# EAGLE design ULN2003_SingleStrip_ThinkerKit_v02 (EAGLE 5.09)
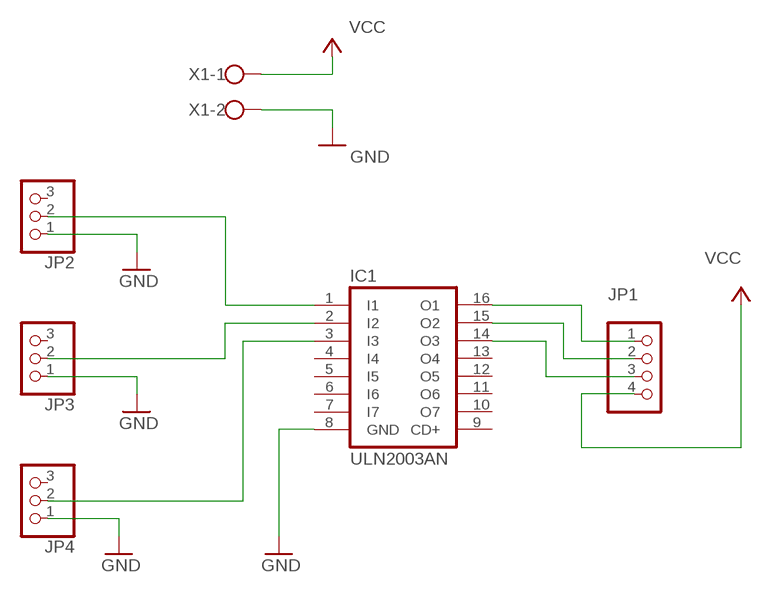
[diagram p0: schematic, sheet 1]

## Parts
IC1  ULN2003AN  [DIL16]
JP1  PINHD-1X4  [1X04]
JP2  PINHD-1X3  [1X03]
JP3  PINHD-1X3  [1X03]
JP4  PINHD-1X3  [1X03]
X1  W237-102  [W237-102]

## Nets
GND: IC1.8(GND) JP2.1 JP3.1 JP4.1 X1.2
N$1: IC1.3(I3) JP4.2
N$2: IC1.2(I2) JP3.2
N$3: IC1.1(I1) JP2.2
N$4: IC1.16(O1) JP1.1
N$5: IC1.15(O2) JP1.2
N$6: IC1.14(O3) JP1.3
VCC: JP1.4 X1.1
Unconnected: IC1.4(I4) IC1.5(I5) IC1.6(I6) IC1.7(I7) IC1.9(CD+) IC1.10(O7) IC1.11(O6) IC1.12(O5) IC1.13(O4) JP2.3 JP3.3 JP4.3

## Library data of the parts
IC1 = uln-udn:ULN2003A: DRIVER ARRAY
JP1 = pinhead:PINHD-1X4: PIN HEADER
JP2-JP4 = pinhead:PINHD-1X3: PIN HEADER
X1 = con-wago-500:W237-102: WAGO SCREW CLAMP

## Board
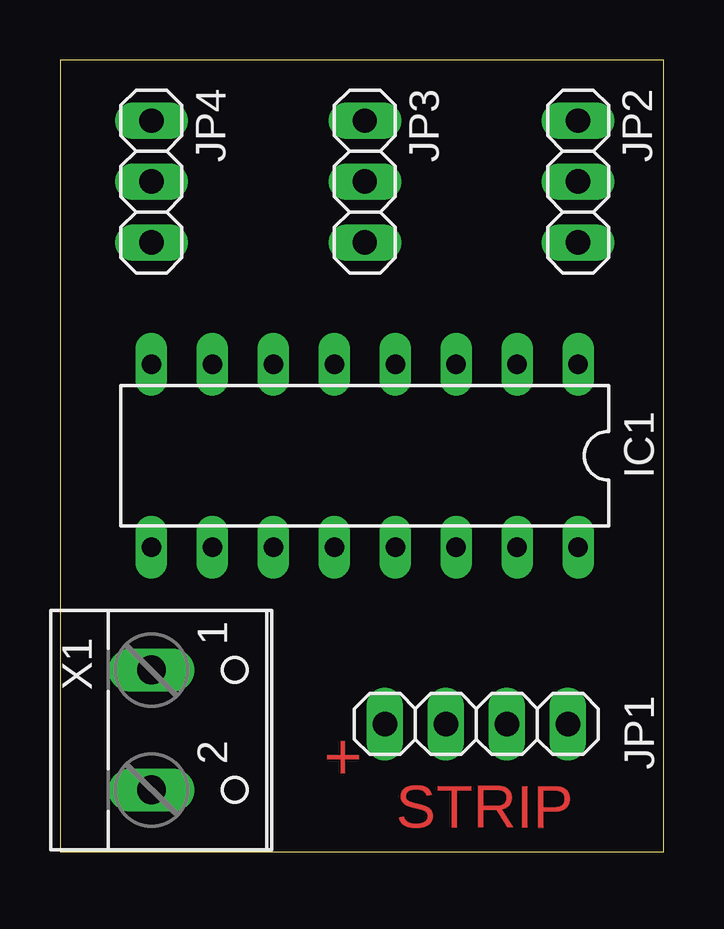
[diagram p1: board, top side]
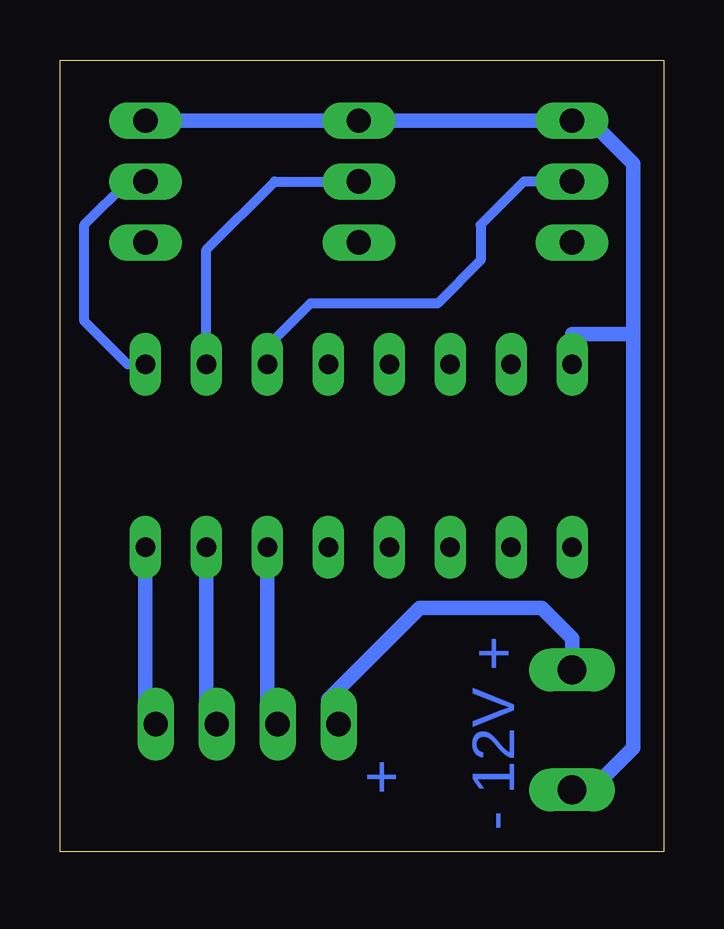
[diagram p2: board, bottom side, seen from below]

Size 25.15 x 33.01 mm. Coordinates in mm from the lower left corner, seen from the top.
Outline: 0,0 25.15,0 25.15,33.01 0,33.01 0,0
Copper layers (1*16): Top 0.035mm / dielectric 1.5mm / Bottom 0.035mm
Design rules "default": minimum track width 10mil, minimum drill 24mil, track to track 8mil, track to pad 8mil, pad to pad 8mil, via to via 8mil, smd to smd 8mil, copper to edge 40mil, drill to drill 8mil, minimum pad ring 10mil, minimum via ring 8mil, stop-mask expansion 4mil, vias tented up to drill 0mil, thermal gap 10mil

### Footprints (pad centres in the part's own frame; a part is rotated, then mirrored left to right if it is on the bottom)
DIL16 = drill 0.813 long: 1 -8.89,-3.81; 2 -6.35,-3.81; 3 -3.81,-3.81; 4 -1.27,-3.81; 5 1.27,-3.81; 6 3.81,-3.81; 7 6.35,-3.81; 8 8.89,-3.81; 9 8.89,3.81; 10 6.35,3.81; 11 3.81,3.81; 12 1.27,3.81; 13 -1.27,3.81; 14 -3.81,3.81; 15 -6.35,3.81; 16 -8.89,3.81
1X04 = drill 1.016 long: 1 -3.81,0; 2 -1.27,0; 3 1.27,0; 4 3.81,0
1X03 = drill 1.016 long: 1 -2.54,0; 2 0,0; 3 2.54,0
W237-102 = drill 1.194 long: 1 -2.5,-1.27; 2 2.5,-1.27

### Placement (x,y rotation side)
IC1  12.7,16.51 180 top
JP1  17.35,5.33 180 top
JP2  21.59,27.94 270 top
JP3  12.7,27.94 270 top
JP4  3.81,27.94 270 top
X1  5.08,5.08 270 top

### Tracks (layer width: path | path; a pad name or v marks a point on that pad's centre or on a via)
GND
  Bottom 0.254: 3.81,2.54 X1.2
  Bottom 0.61: IC1.8 3.81,21.59 1.27,21.59 | 1.27,21.59 1.27,28.68 3.07,30.48 JP4.1 JP3.1 JP2.1 | 3.07,2.54 2.97,2.54 | 3.07,2.54 3.81,2.54 | 3.07,2.54 1.27,4.34 1.27,21.59
N$1
  Bottom 0.406: JP4.2 5.82,27.94 7.62,26.14 7.62,24.66 9.42,22.86 14.71,22.86 16.51,21.06 IC1.3
N$2
  Bottom 0.406: IC1.2 19.05,25.1 16.21,27.94 JP3.2
N$3
  Bottom 0.406: IC1.1 22.33,20.32 24.13,22.12 24.13,26.14 22.33,27.94 JP2.2
N$4
  Bottom 0.254: JP1.1 21.59,6.35
  Bottom 0.61: 21.59,6.35 IC1.16
N$5
  Bottom 0.254: 19.05,11.43 IC1.15 | JP1.2 19.05,6.35
  Bottom 0.61: 19.05,6.35 19.05,11.43
N$6
  Bottom 0.254: 16.51,11.43 IC1.14 | JP1.3 16.51,6.35
  Bottom 0.61: 16.51,6.35 16.51,11.43
VCC
  Bottom 0.254: 13.97,6.35 JP1.4 | X1.1 3.81,7.62
  Bottom 0.61: 13.97,6.35 10.16,10.16 5.08,10.16 3.81,8.89 3.81,7.62

### Text on the board
Top: + | STRIP
Bottom: - 12V + | +